# Altium schematic sheet CAN.SchDoc: CAN transciever
size A4; Engineer: Danel Tiitma; DocumentNumber: 5; Revision: 1; SheetNumber: 5; SheetTotal: 15
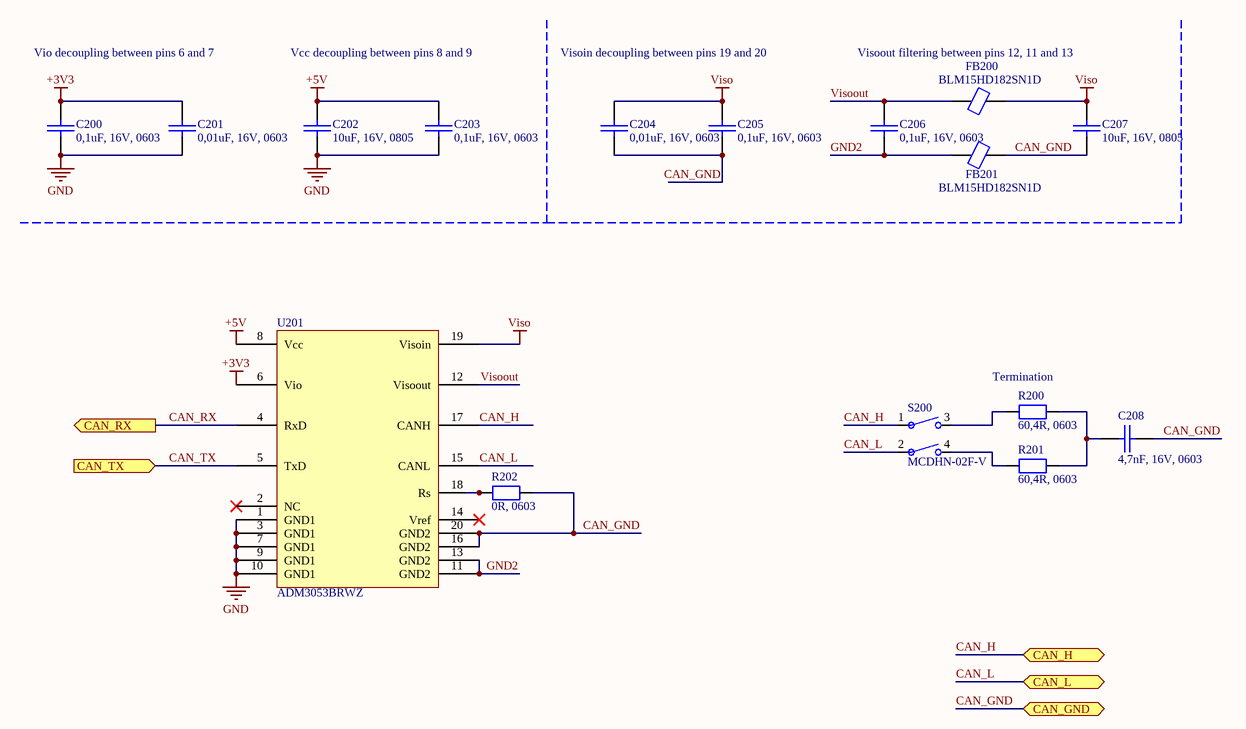
[diagram p0: CAN.SchDoc]

## Parts
C200  0,1uF, 16V, 0603  [CAP [0603] 1608]
C201  0,01uF, 16V, 0603  [CAP [0603] 1608]
C202  10uF, 16V, 0805  [CAP [0805] 2012]
C203  0,1uF, 16V, 0603  [CAP [0603] 1608]
C204  0,01uF, 16V, 0603  [CAP [0603] 1608]
C205  0,1uF, 16V, 0603  [CAP [0603] 1608]
C206  0,1uF, 16V, 0603  [CAP [0603] 1608]
C207  10uF, 16V, 0805  [CAP [0805] 2012]
C208  4,7nF, 16V, 0603  [CAP [0603] 1608]
FB200  BLM15HD182SN1D  [IND [0402] 1005]
FB201  BLM15HD182SN1D  [IND [0402] 1005]
R200  60,4R, 0603  [RES [0603] 1608]
R201  60,4R, 0603  [RES [0603] 1608]
R202  0R, 0603  [RES [0603] 1608]
S200  MCDHN-02F-V  [MCDHN-02F-V-Footprint-1]
U201  ADM3053BRWZ  [SOIC-20]

## Ports
CAN_GND (bidir), CAN_H (bidir), CAN_L (bidir), CAN_RX (out), CAN_TX (in)

## Nets
+3V3: C200.1 C201.1 U201.6(Vio)
+5V: C202.1 C203.1 U201.8(Vcc)
GND: C200.2 C201.2 C202.2 C203.2 U201.1(GND1) U201.3(GND1) U201.7(GND1) U201.9(GND1) U201.10(GND1)
Viso: C204.1 C205.1 C207.1 FB200.2 U201.19(Visoin)
CAN_GND: C204.2 C205.2 C207.2 C208.2 FB201.2 R202.1 U201.16(GND2) U201.20(GND2) ; port CAN_GND
CAN_H: S200.1 U201.17(CANH) ; port CAN_H
CAN_L: S200.2 U201.15(CANL) ; port CAN_L
CAN_RX: U201.4(RxD) ; port CAN_RX
CAN_TX: U201.5(TxD) ; port CAN_TX
GND2: C206.2 FB201.1 U201.11(GND2) U201.13(GND2)
Visoout: C206.1 FB200.1 U201.12(Visoout)
NetC208_1: C208.1 R200.1 R201.1
NetR200_2: R200.2 S200.3
NetR201_2: R201.2 S200.4
NetR202_2: R202.2 U201.18(Rs)

Not connected (* = marked no-connect by the designer): U201 2(NC)* 14(Vref)*

## Notes on the sheet
- Vio decoupling between pins 6 and 7
- Vcc decoupling between pins 8 and 9
- Visoin decoupling between pins 19 and 20
- Visoout filtering between pins 12, 11 and 13
- (near R200) Termination
- Engineer:
- Date:
- Rev:

## Library data of the parts
C200-C208 = CMP-001-00084-16: Default capacitor part; Supplier Part Number: *; Supplier: *; Manufacturer Part Number: *
FB200 FB201 = CMP-006-00015-1: Ferrite Chip, 1 Function(s), 0.2A, 2 Pin(s); Manufacturer: Murata; Supplier: Digikey; Manufacturer Part Number: BLM15HD182SN1D; Supplier Part Number: 490-5196-1-ND; Price: 0.15
R200-R202 = CMP-009-00038-12: Standard resistor part; Supplier Part Number: *; Manufacturer Part Number: *; Supplier: *
S200 = CMP-011-00017-4: Slide Dip Switch, 2 Switches, SPST, Latched, 0.025A, 24VDC, Solder Terminal, Surface Mount-straight; Manufacturer: Multicomp Pro; Supplier Part Number: 1605473; Price: 1,26; Supplier: Farnell; Manufacturer Part Number: MCDHN-02F-V; Datasheet: https://www.farnell.com/datasheets/3723159.pdf
U201 = CMP-015-00008-3: Interface Circuit, 1-Trnsvr, PDSO20; Manufacturer: Analog Devices; Price: 13,48; Manufacturer Part Number: ADM3053BRWZ; Supplier Part Number: 584-ADM3053BRWZ-R7; Datasheet: https://www.mouser.ee/datasheet/2/609/ADM3053-3120613.pdf; Supplier: Mouser